# EAGLE design LB_BIT_1IN_2OUT-XL-v03(1_1x) (EAGLE 6.5.0)
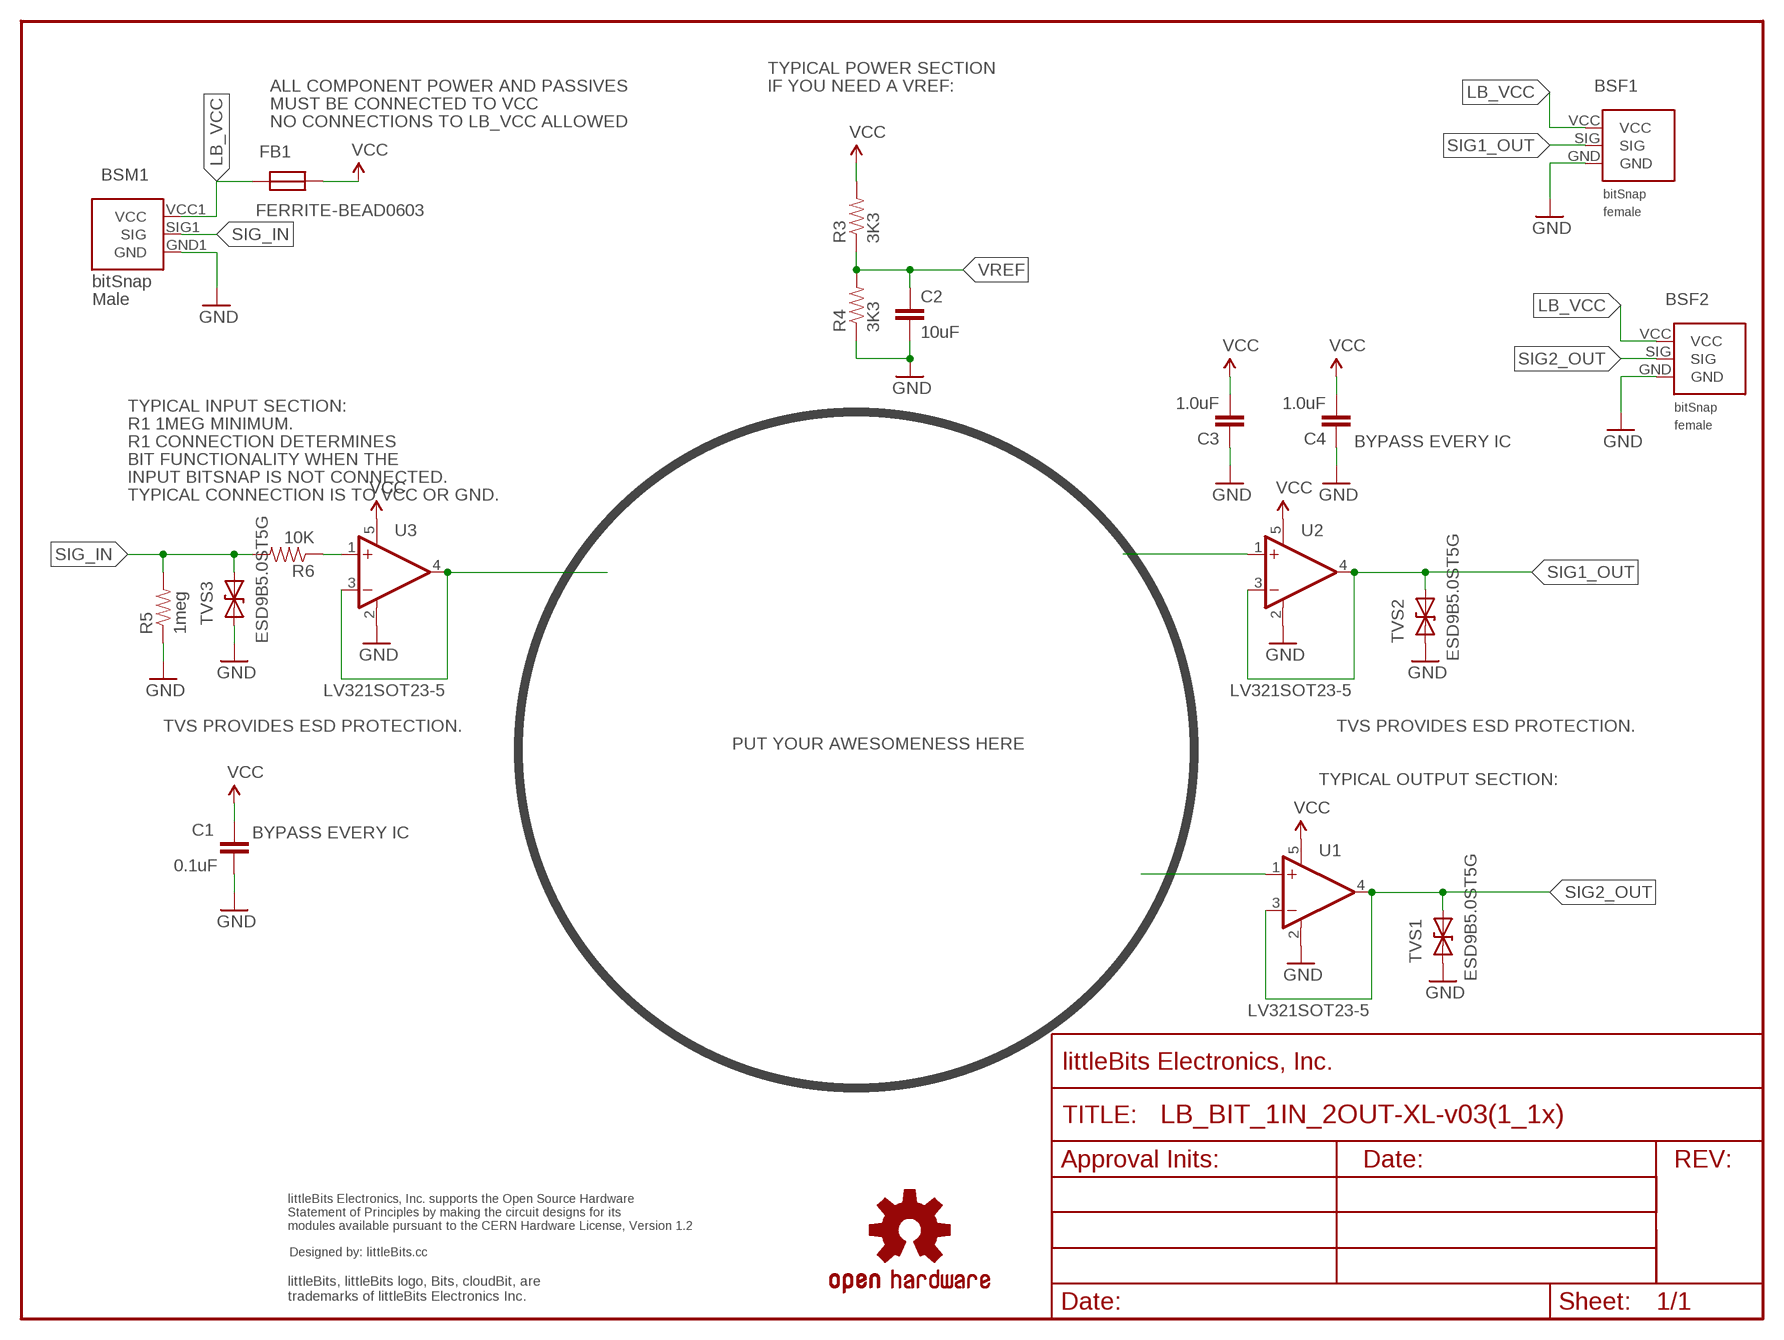
[diagram p0: schematic, sheet 1]

## Parts
BSF1  BITSNAP_V03_FEMALE  [BITSNAP_V03_FEMALE]
BSF2  BITSNAP_V03_FEMALE  [BITSNAP_V03_FEMALE]
BSM1  BITSNAP_V03_MALE  [BITSNAP_V03_MALE]
C1  0.1uF  CAPCAP-0603  [CAP-0603]
C2  10uF  CAPCAP-0603  [CAP-0603]
C3  1.0uF  CAPCAP-0603  [CAP-0603]
C4  1.0uF  CAPCAP-0603  [CAP-0603]
FB1  FERRITE-BEAD0603  [R0603]
FRAME1  FRAME-LETTER  [FABDWG01-OHW]
R3  3K3  RESISTOR0603  [RES-0603]
R4  3K3  RESISTOR0603  [RES-0603]
R5  1meg  RESISTOR0603  [RES-0603]
R6  10K  RESISTOR0603  [RES-0603]
TVS1  ESD9B5.0ST5G  DIODE-TVSSOD-923  [SOD-923]
TVS2  ESD9B5.0ST5G  DIODE-TVSSOD-923  [SOD-923]
TVS3  ESD9B5.0ST5G  DIODE-TVSSOD-923  [SOD-923]
U1  LV321SOT23-5  [SOT23-5]
U2  LV321SOT23-5  [SOT23-5]
U3  LV321SOT23-5  [SOT23-5]
U$1  OSHW-LOGOL  [OSHW-LOGO-L]
U$2  OSHWCREDIT  [OSHWCREDIT]

## Nets
GND: BSF1.GND BSF2.GND BSM1.GND1(GND) C1.2 C2.2 C3.1 C4.1 R4.1 R5.1 TVS1.1(A) TVS2.1(A) TVS3.1(A) U1.2(V-) U2.2(V-) U3.2(V-)
LB_VCC: BSF1.VCC BSF2.VCC BSM1.VCC1(VCC) FB1.2
N$1: U3.3(-IN) U3.4(OUT)
N$2: U1.1(+IN)
N$3: U2.1(+IN)
N$5: R6.1 U3.1(+IN)
SIG1_OUT: BSF1.SIG TVS2.2(C) U2.3(-IN) U2.4(OUT)
SIG2_OUT: BSF2.SIG TVS1.2(C) U1.3(-IN) U1.4(OUT)
SIG_IN: BSM1.SIG1(SIG) R5.2 R6.2 TVS3.2(C)
VCC: C1.1 C3.2 C4.2 FB1.1 R3.2 U1.5(V+) U2.5(V+) U3.5(V+)
VREF: C2.1 R3.1 R4.2

## Notes on the sheet
- TYPICAL POWER SECTION
- ALL COMPONENT POWER AND PASSIVES | IF YOU NEED A VREF:
- MUST BE CONNECTED TO VCC
- NO CONNECTIONS TO LB_VCC ALLOWED
- TYPICAL INPUT SECTION:
- R1 1MEG MINIMUM.
- R1 CONNECTION DETERMINES | BYPASS EVERY IC
- BIT FUNCTIONALITY WHEN THE
- INPUT BITSNAP IS NOT CONNECTED.
- TYPICAL CONNECTION IS TO VCC OR GND.
- TVS PROVIDES ESD PROTECTION. | TVS PROVIDES ESD PROTECTION.
- PUT YOUR AWESOMENESS HERE
- TYPICAL OUTPUT SECTION:
- BYPASS EVERY IC

## Library data of the parts
BSF1 BSF2 = bitSnap:BITSNAP_V03_FEMALE
BSM1 = bitSnap:BITSNAP_V03_MALE
C1-C4 = LITTLEBITS:CAP
FB1 = LITTLEBITS:FERRITE-BEAD
FRAME1 = LITTLEBITS:FRAME-LETTER
R3-R6 = LITTLEBITS:RESISTOR
TVS1-TVS3 = LITTLEBITS:DIODE-TVS: Bidirectional Transient Voltage Suppression Diode: Device conducts in avalanche mode after reaching a part dependent voltage threshold. Used for limiting voltage spikes on ESD sensitive inputs and outputs.; IEC_ESD_PROT0: +/-18kV; LB_PN: ?; MPN: ESD9B5.0ST5G; V_CLAMP: ?; V_OPERATION: 5V
U1-U3 = LITTLEBITS:LV321
U$1 = LITTLEBITS131206:OSHW-LOGO: Open Source Hardware Logo This logo indicates the piece of hardware it is found on incorporates a OSHW license and/or adheres to the definition of open source hardware found here: http://freedomdefined.org/OSHW
U$2 = LITTLEBITS:OSHWCREDIT

## Board
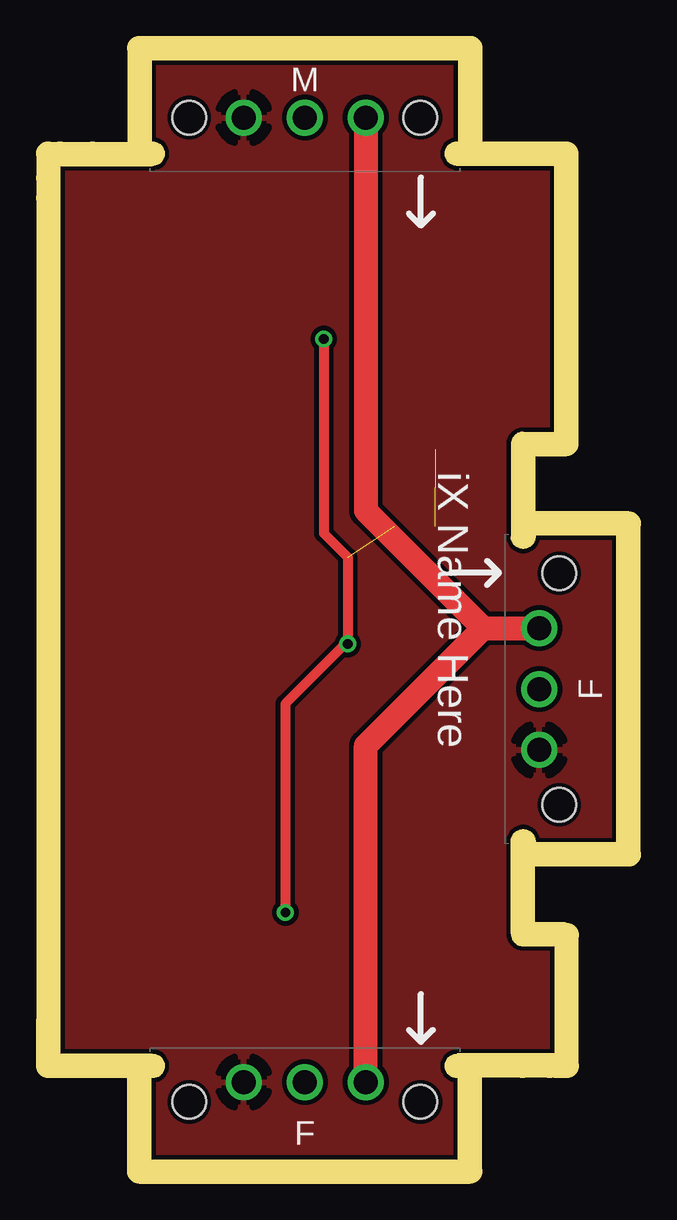
[diagram p1: board, top side]
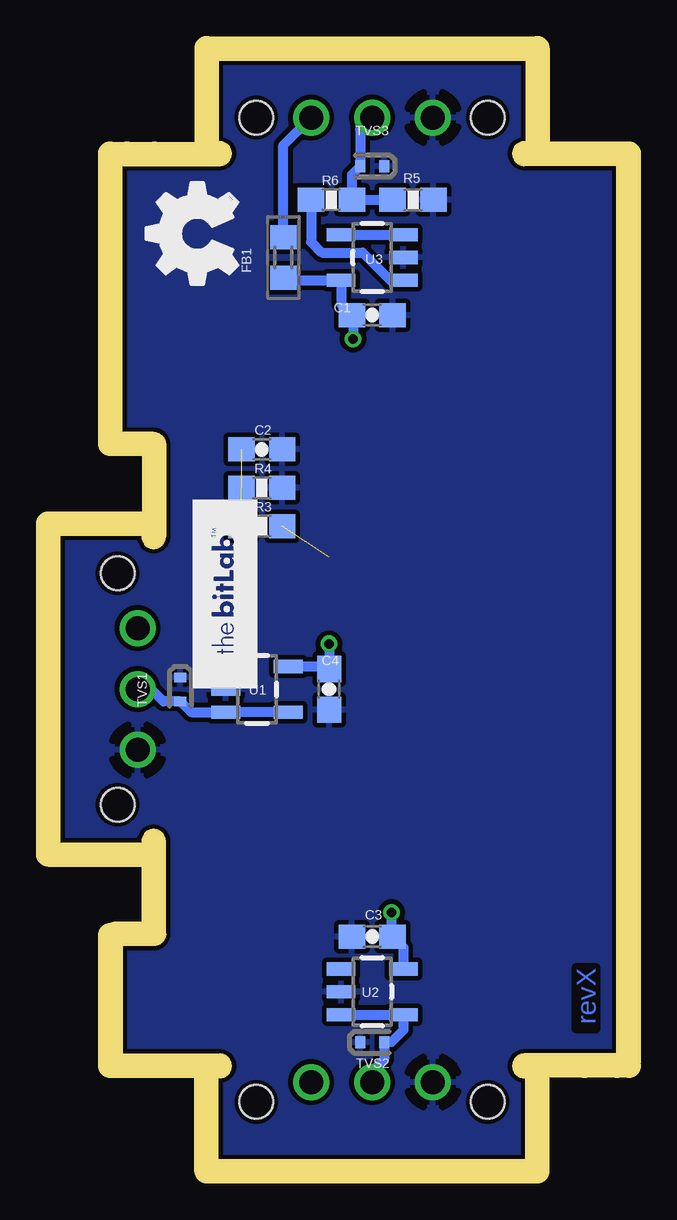
[diagram p2: board, bottom side, seen from below]

Size 23.2 x 45.81 mm. Coordinates in mm from the lower left corner, seen from the top.
Outline: 18.8,9.4 arc90 19.3,8.9 20.62,8.9 20.62,4.4 20.4,4.4
Outline: 18.8,29.8 arc-90 19.3,30.3 20.61,30.3 20.61,41.41 20.23,41.41
Outline: 0,41.41 0,4.4 0.03,4.4
Copper layers (1*16): Top 0.035mm / dielectric 1.5mm / Bottom 0.035mm
Design rules "littleBitsDRC": minimum track width 0.2mm, minimum drill 0.4mm, track to track 0.2mm, track to pad 0.2mm, pad to pad 0.2mm, via to via 0.2mm, smd to smd 0mil, copper to edge 0.2mm, drill to drill 0.2mm, minimum pad ring 0.2mm, minimum via ring 0.15mm, stop-mask expansion 0.1mm, vias tented up to drill 0mil, thermal gap 0.2mm
Milling: 13 lines

### Footprints (pad centres in the part's own frame; a part is rotated, then mirrored left to right if it is on the bottom)
BITSNAP_V03_FEMALE = drill 1: GND 4.065,3.44; SIG 6.605,3.44; VCC 9.145,3.44 | hole 1.4: 1.785,2.61; 11.425,2.61
BITSNAP_V03_MALE = drill 1: GND1 9.145,2.61; SIG1 6.605,2.61; VCC1 4.065,2.61 | hole 1.4: 1.785,2.61; 11.425,2.61
CAP-0603 = smd 1.1 x 1: 1 -0.85,0; 2 0.85,0
R0603 = smd 1 x 1.1: 1 -0.85,0; 2 0.85,0
RES-0603 = smd 1.1 x 1: 1 -0.85,0; 2 0.85,0
SOD-923 = smd 0.4 x 0.5: 1 -0.5,0; 2 0.5,0
SOT23-5 = smd 0.55 x 1.2: 1 -0.95,-1.3; 2 0,-1.3; 3 0.95,-1.3; 4 0.95,1.3; 5 -0.95,1.3

### Placement (x,y rotation side)
BSF1  3.6,-0.21 0 top
BSF2  23.41,13 90 top
BSM1  16.8,46.02 180 top
C1  10.19,35.19 0 bottom
C2  14.79,29.59 0 bottom
C3  10.19,9.29 0 bottom
C4  11.99,19.59 90 bottom
FB1  13.89,37.59 90 bottom
FRAME1  -3.01,-0.21 0 top  (outside the outline)
R3  14.79,26.39 0 bottom
R4  14.79,27.99 180 bottom
R5  8.49,39.99 180 bottom
R6  11.89,39.99 0 bottom
TVS1  18.19,19.59 270 bottom
TVS2  10.19,4.89 0 bottom
TVS3  10.19,41.39 180 bottom
U1  14.99,19.59 270 bottom
U2  10.19,6.99 270 bottom
U3  10.19,37.59 90 bottom
U$1  -36.03,-65.8 0 top  (outside the outline)
U$2  -90.01,-58.75 0 top  (outside the outline)
U$3  [BITLAB-LOGO]  14.99,27.49 270 top
U$8  [OSHW_FILLX150_NOTEXT]  15.8,35.63 0 top

### Tracks (layer width: path | path; a pad name or v marks a point on that pad's centre or on a via)
GND
  pour Bottom: -0.01,0.07 23.19,0.07 23.19,45.97 -0.01,45.97
  pour Top: -0.01,0.07 23.19,0.07 23.19,45.97 -0.01,45.97
LB_VCC
  Top 1: BSM1.VCC1 12.74,27.04 17.63,22.14 | 17.63,22.14 BSF2.VCC | BSF1.VCC 12.74,17.25 17.63,22.14
  Bottom 0.406: FB1.2 13.89,42.27 BSM1.VCC1
N$1
  Bottom 0.406: U3.4 U3.3
N$5
  Bottom 0.406: R6.1 12.74,38.24 12.29,37.79 10.59,37.79 9.44,36.64 U3.1
SIG1_OUT
  Bottom 0.406: U2.3 U2.4 8.89,5.39 9.39,4.89 TVS2.2 9.69,4.19 10.2,3.68 BSF1.SIG
SIG2_OUT
  Bottom 0.406: U1.4 U1.3 17.74,18.64 TVS1.2 18.89,19.09 19.41,19.61 BSF2.SIG
SIG_IN
  Bottom 0.406: BSM1.SIG1 10.69,42.92 TVS3.2 11.04,41.04 R6.2 R5.2
VCC  (via drill 0.4)  (1 unrouted)
  Top 0.406: v10.99,34.19 10.99,26.09 11.99,25.09 11.99,21.59 | 11.99,21.59 v11.99,21.49 | 11.99,21.59 9.39,18.99 v9.39,10.29
  Bottom 0.406: FB1.1 13.79,36.64 U3.5 11.49,35.64 C1.1 10.99,35.14 v10.99,34.19 | v11.99,21.49 C4.2 12.09,20.54 U1.5 | v9.39,10.29 9.39,9.34 C3.2 8.89,8.84 U2.5
VREF  (2 unrouted)

### Text on the board
Bottom: revX
tPlace: iX Name Here
Reference: XLARGE